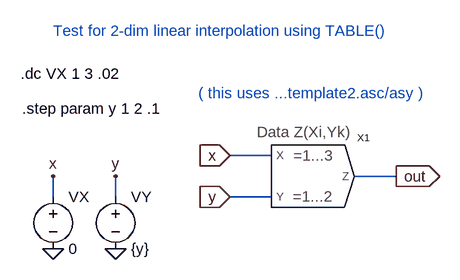
[diagram p0: schematic 2D_Interpolation_TEST2.asc]
2D_Interpolation_TEST2.asc, the LTspice schematic file:
Version 4
SHEET 1 1612 680
WIRE -112 112 -112 80
WIRE -16 112 -16 80
WIRE 224 48 160 48
WIRE 224 112 160 112
WIRE 416 80 352 80
FLAG -112 192 0
FLAG -112 80 x
FLAG -16 192 0
FLAG -16 80 y
FLAG 160 48 x
IOPIN 160 48 In
FLAG 160 112 y
IOPIN 160 112 In
FLAG 416 80 out
IOPIN 416 80 Out
SYMBOL voltage -112 96 R0
SYMATTR InstName VX
SYMATTR Value 0
SYMBOL voltage -16 96 R0
WINDOW 123 0 0 Left 0
WINDOW 39 0 0 Left 0
SYMATTR InstName VY
SYMATTR Value {y}
SYMBOL 2D_Interpolation_template2 272 80 R0
SYMATTR InstName X1
TEXT -162 -78 Left 0 !.dc VX 1 3 .02
TEXT -160 -24 Left 0 !.step param y 1 2 .1
TEXT -112 -144 Left 0 ;Test for 2-dim linear interpolation using TABLE()
TEXT 112 -48 Left 0 ;( this uses ...template2.asc/asy )

The netlist it stands for:
* 2D_Interpolation_TEST2.asc
VX x 0 0
VY y 0 {y}
XX1 x y out 2D_Interpolation_template2  ; pins X Y Z
.dc VX 1 3 .02
.step param y 1 2 .1
* Test for 2-dim linear interpolation using TABLE()
* ( this uses ...template2.asc/asy )
.backanno
.end